# Altium schematic sheet MUX.SchDoc
size A4
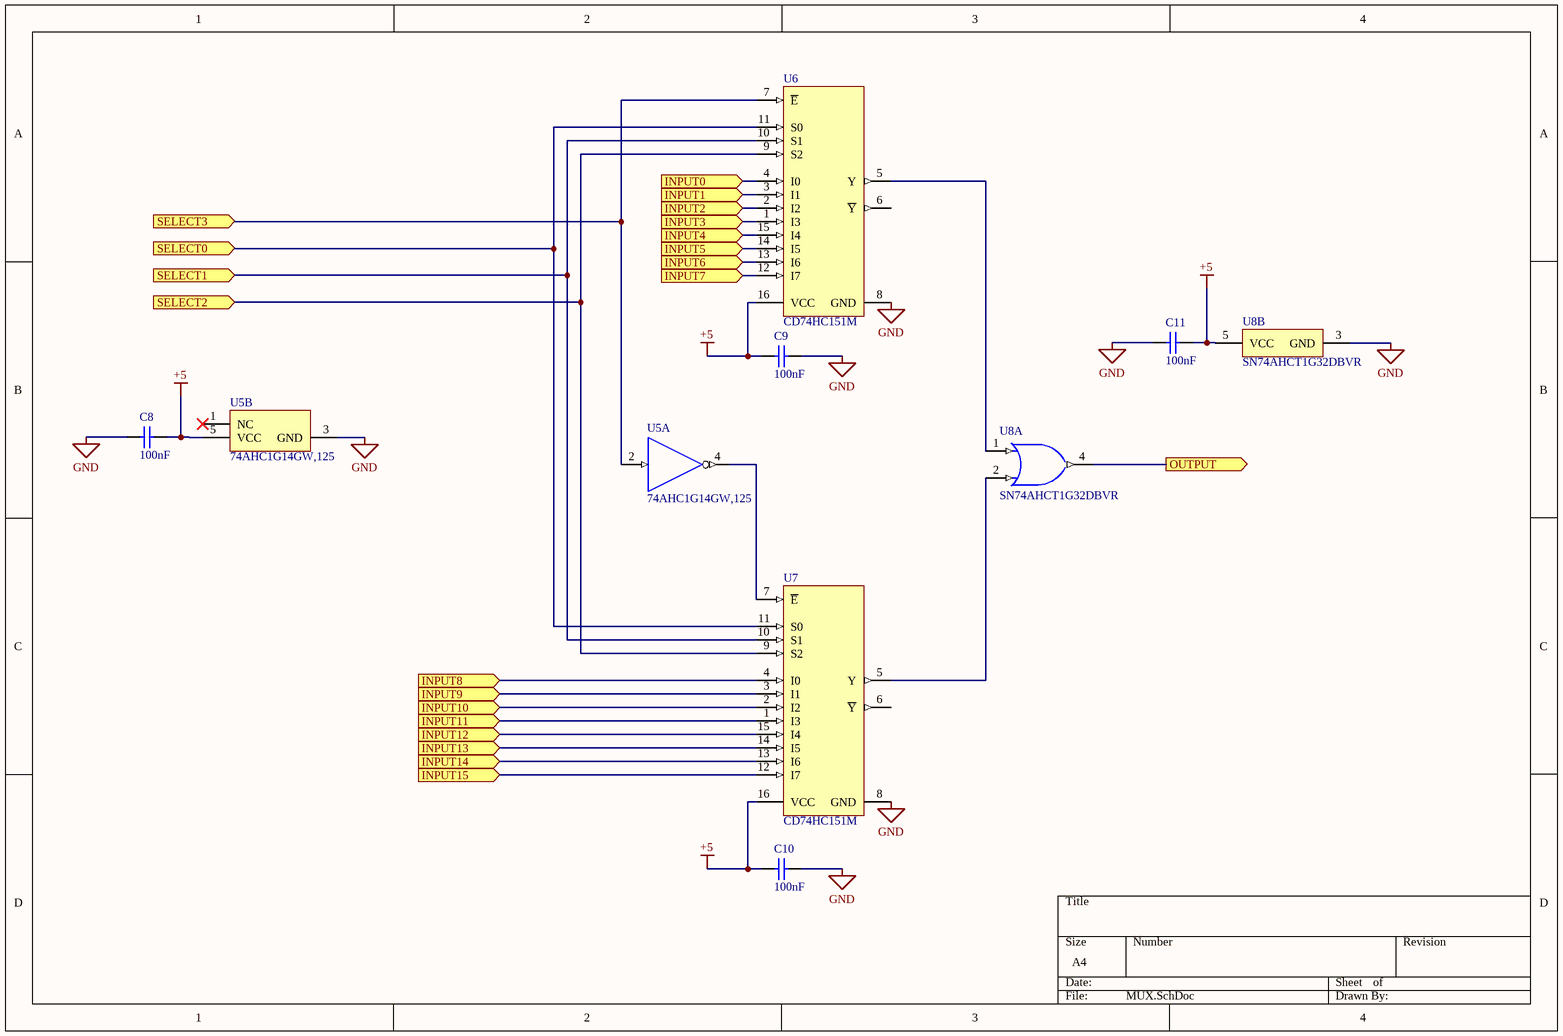
[diagram p0: MUX.SchDoc]

## Parts
C8  100nF  [CAPC1206(3216)150_M]
C9  100nF  [CAPC1206(3216)150_M]
C10  100nF  [CAPC1206(3216)150_M]
C11  100nF  [CAPC1206(3216)150_M]
U5  74AHC1G14GW,125  [NXP-SOT353-1_L]  (parts A,B of 2)
U6  CD74HC151M  [D0016A_N]
U7  CD74HC151M  [D0016A_N]
U8  SN74AHCT1G32DBVR  [DBV0005A_M]  (parts A,B of 2)

## Ports
INPUT0 (in), INPUT1 (in), INPUT2 (in), INPUT3 (in), INPUT4 (in), INPUT5 (in), INPUT6 (in), INPUT7 (in), INPUT8 (in), INPUT9 (in), INPUT10 (in), INPUT11 (in), INPUT12 (in), INPUT13 (in), INPUT14 (in), INPUT15 (in), OUTPUT (out), SELECT0 (in), SELECT1 (in), SELECT2 (in), SELECT3 (in)

## Nets
+5: C8.2 C9.1 C10.1 C11.2 U5.5(VCC) U6.16(VCC) U7.16(VCC) U8.5(VCC)
GND: C8.1 C9.2 C10.2 C11.1 U5.3(GND) U6.8(GND) U7.8(GND) U8.3(GND)
INPUT0: U6.4(I0) ; port INPUT0
INPUT1: U6.3(I1) ; port INPUT1
INPUT2: U6.2(I2) ; port INPUT2
INPUT3: U6.1(I3) ; port INPUT3
INPUT4: U6.15(I4) ; port INPUT4
INPUT5: U6.14(I5) ; port INPUT5
INPUT6: U6.13(I6) ; port INPUT6
INPUT7: U6.12(I7) ; port INPUT7
INPUT8: U7.4(I0) ; port INPUT8
INPUT9: U7.3(I1) ; port INPUT9
INPUT10: U7.2(I2) ; port INPUT10
INPUT11: U7.1(I3) ; port INPUT11
INPUT12: U7.15(I4) ; port INPUT12
INPUT13: U7.14(I5) ; port INPUT13
INPUT14: U7.13(I6) ; port INPUT14
INPUT15: U7.12(I7) ; port INPUT15
OUTPUT: U8.4(Y) ; port OUTPUT
SELECT0: U6.11(S0) U7.11(S0) ; port SELECT0
SELECT1: U6.10(S1) U7.10(S1) ; port SELECT1
SELECT2: U6.9(S2) U7.9(S2) ; port SELECT2
SELECT3: U5.2(A) U6.7(~{E}) ; port SELECT3
NetU5_4: U5.4(~{Y}) U7.7(~{E})
NetU6_5: U6.5(Y) U8.1(A)
NetU7_5: U7.5(Y) U8.2(B)

Not connected (* = marked no-connect by the designer): U5 1(NC)*; U6 6(~{Y}); U7 6(~{Y})

## Library data of the parts
C8-C11 = CMP-1037-04229-1: CAP 100nF 250V ±10% 1206 (3216 Metric) Thickness 1.45mm SMD; Case-EIA: 1206; Tolerance: Â±10%; Case-Metric: 3216; Technology: SMT; Rated Voltage: 250 V; Max Thickness: 1.45 mm; Value: 100nF
U5 = CMP-2000-05678-1: Inverting Schmitt Trigger, 1 uA, 2 to 5.5 V, -40 to 125 degC, 5-Pin TSSOP (SOT353-1), RoHS, Reel; Manufacturer: NXP Semiconductors; Other Names: 568-2502-6; Voltage - Supply: 2V~5.5V; Dynamic Catalog: 74AHC; Current - Quiescent (Max): 1µA; Logic Level - Low: 0.9V~1.65V; Number of Inputs: 1; Product Training Modules: LogicPackages; Logic Level - High: 2.2V~3.85V; Max Propagation Delay @ V, Max CL: 10.6ns@4.5V~5.5V,50pF; Current - Output High, Low: 8mA,8mA; Logic Type: Inverter,Buffer; Mounting Type: SurfaceMount; Series: 74AHC; Family: Logic-GatesandInverters; Category: IntegratedCircuits(ICs); Packaging: Digi-Reel®; Number of Circuits: 1; Manufacturer URL: http://www.nxp.com/; Supplier Device Package: 5-TSSOP; Operating Temperature: -40°C~125°C; Features: SchmittTrigger; Package Reference: SOT353-1; Package URL: http://www.nxp.com/documents/outline_drawing/SOT353-1.pdf; Datasheet URL: http://www.nxp.com/documents/data_sheet/74AHC_AHCT1G14.pdf; Mounting Technology: SurfaceMount; Standard Package: 1; Datasheet Version: Rev. 8, 01/2016; Package / Case: 6-TSSOP(5Lead),SC-88A,SOT-353; Package Description: 5-Pin Thin Shrink Small Outline Package, Body 2.05 x 1.25 mm, Pitch 0.65 mm
U6 U7 = CMP-1633-00204-2: High Speed CMOS Logic 8-Input Multiplexer, D0016A, TUBE; Manufacturer: Texas Instruments; VCC(Min)(V): 2; Output Drive (IOL/IOH)(Max)(mA): 5.2/-5.2; F @ Nom Voltage(Max)(Mhz): 28; ICC @ Nom Voltage(Max)(mA): 0.08; tpd @ Nom Voltage(Max)(ns): 43; Voltage(Nom)(V): 3.3,5; Function: Encoder/Multiplexer; Bits(#): 8; Channels(#): 1; Technology Family: HC; Configuration: 8：1; Schmitt Trigger: No; Rating: Catalog; Input Type: LVTTL/CMOS; VCC(Max)(V): 6; Output Type: CMOS; DatasheetVersion: SCHS150C; Code_JEDEC: MS-012 variation AC; Generic Part Number: CD74HC151; Type: Standard; PackageReference: D0016A; Operating Temperature Range(C): -55 to 125
U8 = CMP-0859-00067-3: Single 2-Input Positive-OR Gate, DBV0005A, LARGE T&R; Manufacturer: Texas Instruments; Technology Family: AHCT; VCC(Min)(V): 2; Voltage(Nom)(V): 5; Schmitt Trigger: No; Gate Type: OR; Sub-Family: OR Gate; Input Type: CMOS; ICC @ Nom Voltage(Max)(mA): 0.01; VCC(Max)(V): 5.5; Bits(#): 1; F @ Nom Voltage(Max)(Mhz): 75; Output Drive (IOL/IOH)(Max)(mA): 8/-8; tpd @ Nom Voltage(Max)(ns): 8; Logic: True; Rating: Catalog; Operating Temperature Range(C): -40 to 125; Generic Part Number: SN74AHCT1G32; DatasheetVersion: SCLS320O; PackageReference: DBV0005A; 3-State Output: No; Output Type: CMOS